# Altium schematic sheet 02.SchDoc
size 513 x 386 mm
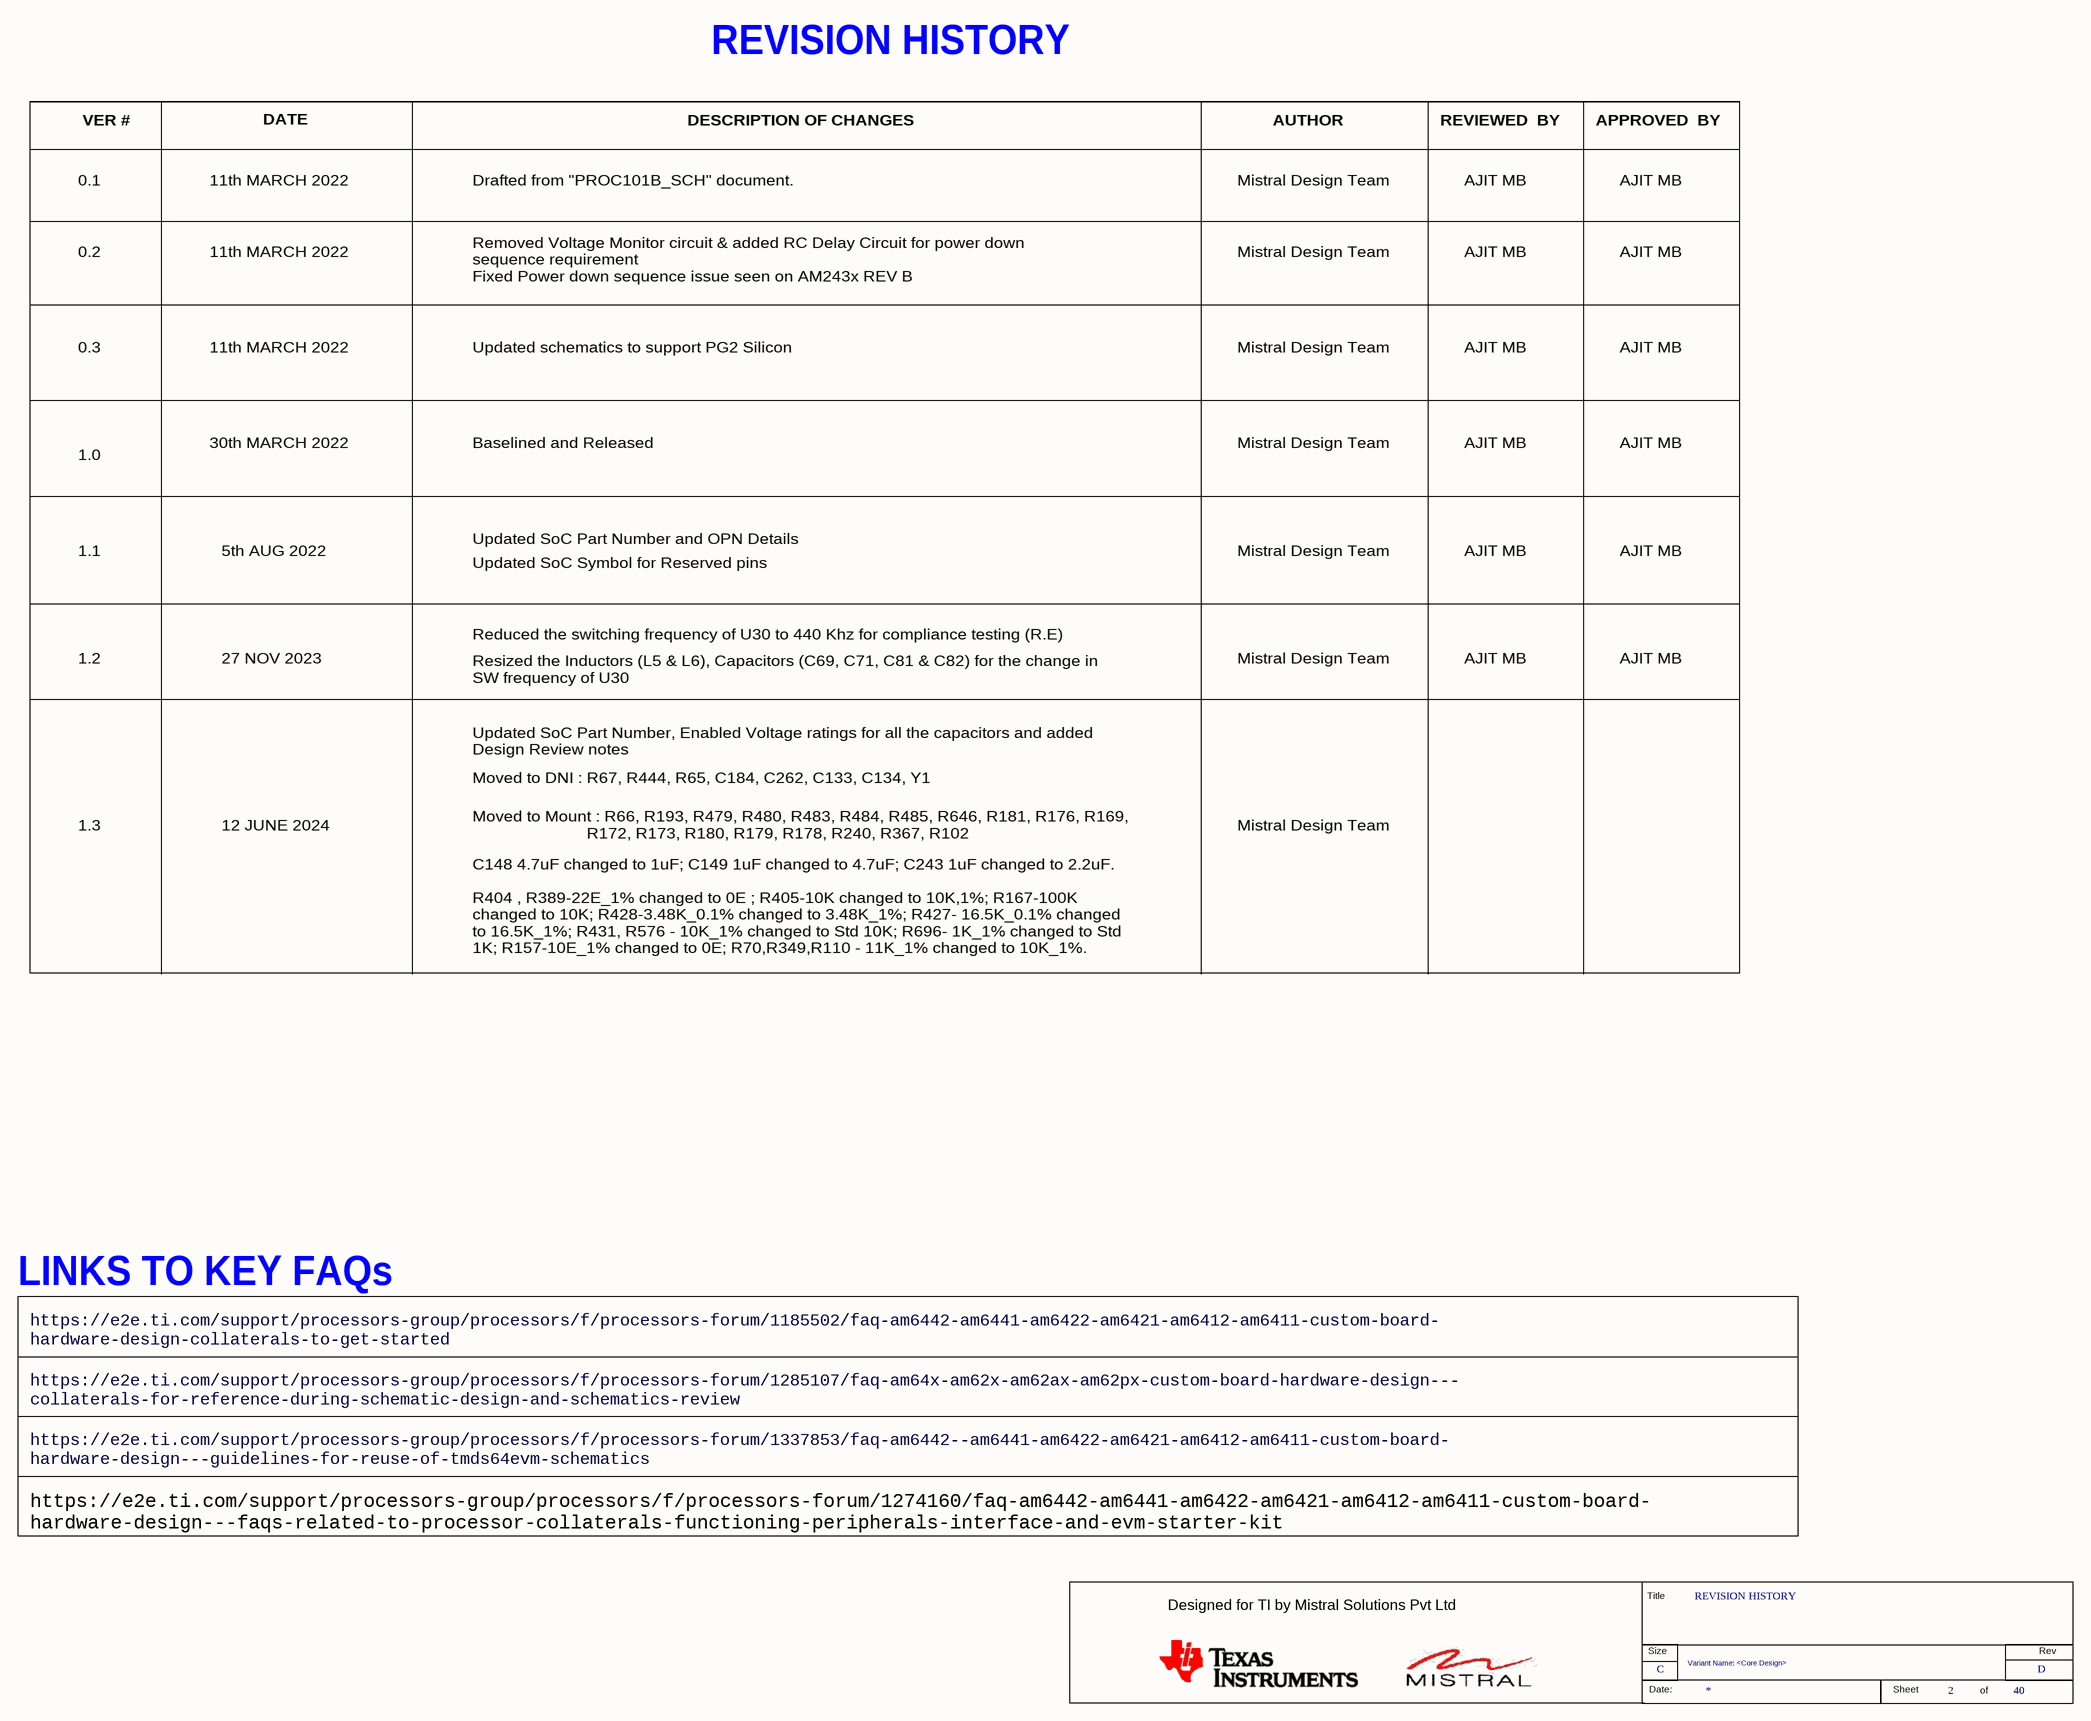
[diagram p0: 02.SchDoc]

## Parts
*  RevCode: D  Title: REVISION HISTORY  Page Size: C  Page Number: 2  Page Count: 40  Variant Name: <Core Design>  (hidden comment: MISTRAL_TITLEBLK_CSIZE)  (graphical)

## Notes on the sheet
- REVISION HISTORY
- VER #
- DATE
- DESCRIPTION OF CHANGES
- AUTHOR
- REVIEWED  BY
- APPROVED  BY
- 0.1
- 11th MARCH 2022
- Drafted from "PROC101B_SCH" document.
- Mistral Design Team
- AJIT MB
- Removed Voltage Monitor circuit & added RC Delay Circuit for power down
  sequence requirement
  Fixed Power down sequence issue seen on AM243x REV B
- 0.2
- 0.3
- Updated schematics to support PG2 Silicon
- 1.0
- 30th MARCH 2022
- Baselined and Released
- Updated SoC Part Number and OPN Details
- 1.1
- 5th AUG 2022
- Updated SoC Symbol for Reserved pins
- 1.2
- 27 NOV 2023
- Reduced the switching frequency of U30 to 440 Khz for compliance testing (R.E)
- Resized the Inductors (L5 & L6), Capacitors (C69, C71, C81 & C82) for the change in
  SW frequency of U30
- Updated SoC Part Number, Enabled Voltage ratings for all the capacitors and added
  Design Review notes
- Moved to DNI : R67, R444, R65, C184, C262, C133, C134, Y1
- 1.3
- 12 JUNE 2024
- Moved to Mount : R66, R193, R479, R480, R483, R484, R485, R646, R181, R176, R169,
  R172, R173, R180, R179, R178, R240, R367, R102
- C148 4.7uF changed to 1uF; C149 1uF changed to 4.7uF; C243 1uF changed to 2.2uF.
  R404 , R389-22E_1% changed to 0E ; R405-10K changed to 10K,1%; R167-100K
  changed to 10K; R428-3.48K_0.1% changed to 3.48K_1%; R427- 16.5K_0.1% changed
  to 16.5K_1%; R431, R576 - 10K_1% changed to Std 10K; R696- 1K_1% changed to Std
  1K; R157-10E_1% changed to 0E; R70,R349,R110 - 11K_1% changed to 10K_1%.
- LINKS TO KEY FAQs
- https://e2e.ti.com/support/processors-group/processors/f/processors-forum/1185502/faq-am6442-am6441-am6422-am6421-am6412-am6411-custom-board-
  hardware-design-collaterals-to-get-started
- https://e2e.ti.com/support/processors-group/processors/f/processors-forum/1285107/faq-am64x-am62x-am62ax-am62px-custom-board-hardware-design---
  collaterals-for-reference-during-schematic-design-and-schematics-review
- https://e2e.ti.com/support/processors-group/processors/f/processors-forum/1337853/faq-am6442--am6441-am6422-am6421-am6412-am6411-custom-board-
  hardware-design---guidelines-for-reuse-of-tmds64evm-schematics
- https://e2e.ti.com/support/processors-group/processors/f/processors-forum/1274160/faq-am6442-am6441-am6422-am6421-am6412-am6411-custom-board-
  hardware-design---faqs-related-to-processor-collaterals-functioning-peripherals-interface-and-evm-starter-kit
- (in symbol MISTRAL_TITLEBLK_CSIZE) Title; Designed for TI by Mistral Solutions Pvt Ltd; Size; Rev; Date:; Sheet; of

## Library data of the parts
* = MISTRAL_TITLEBLK_CSIZE: Issue: 1.0; Page Create Date: March  8, 1995; Page Modify Date: *